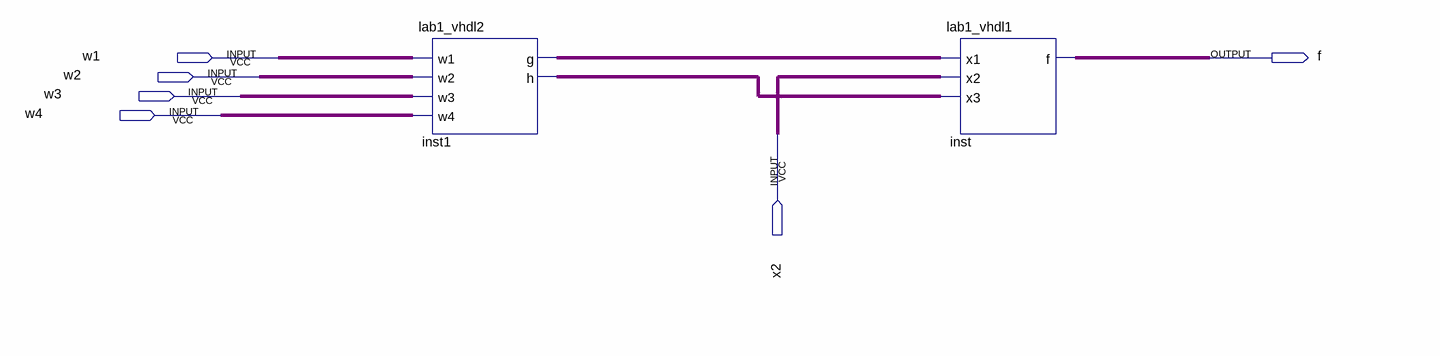
[diagram p0: schematic sheet]
// Quartus schematic lab1_part3_schematic.bdf as structural Verilog: 2 symbols, 6 pins
module lab1_part3_schematic (
  input  w1,
  input  w2,
  input  w3,
  input  w4,
  input  x2,
  output f
);

  wire inst1_g, inst1_h;

  lab1_vhdl2 inst1 (.w1(w1), .w2(w2), .w3(w3), .w4(w4), .g(inst1_g), .h(inst1_h));
  lab1_vhdl1 inst (.x1(inst1_g), .x2(x2), .x3(inst1_h), .f(f));
endmodule
